# Altium schematic sheet IMDAMSLatching.SchDoc
size A4; Date: 2017-12-21; DrawnBy: Tylynn Haddow; Revision: 2; DocumentName: Reset Circuit
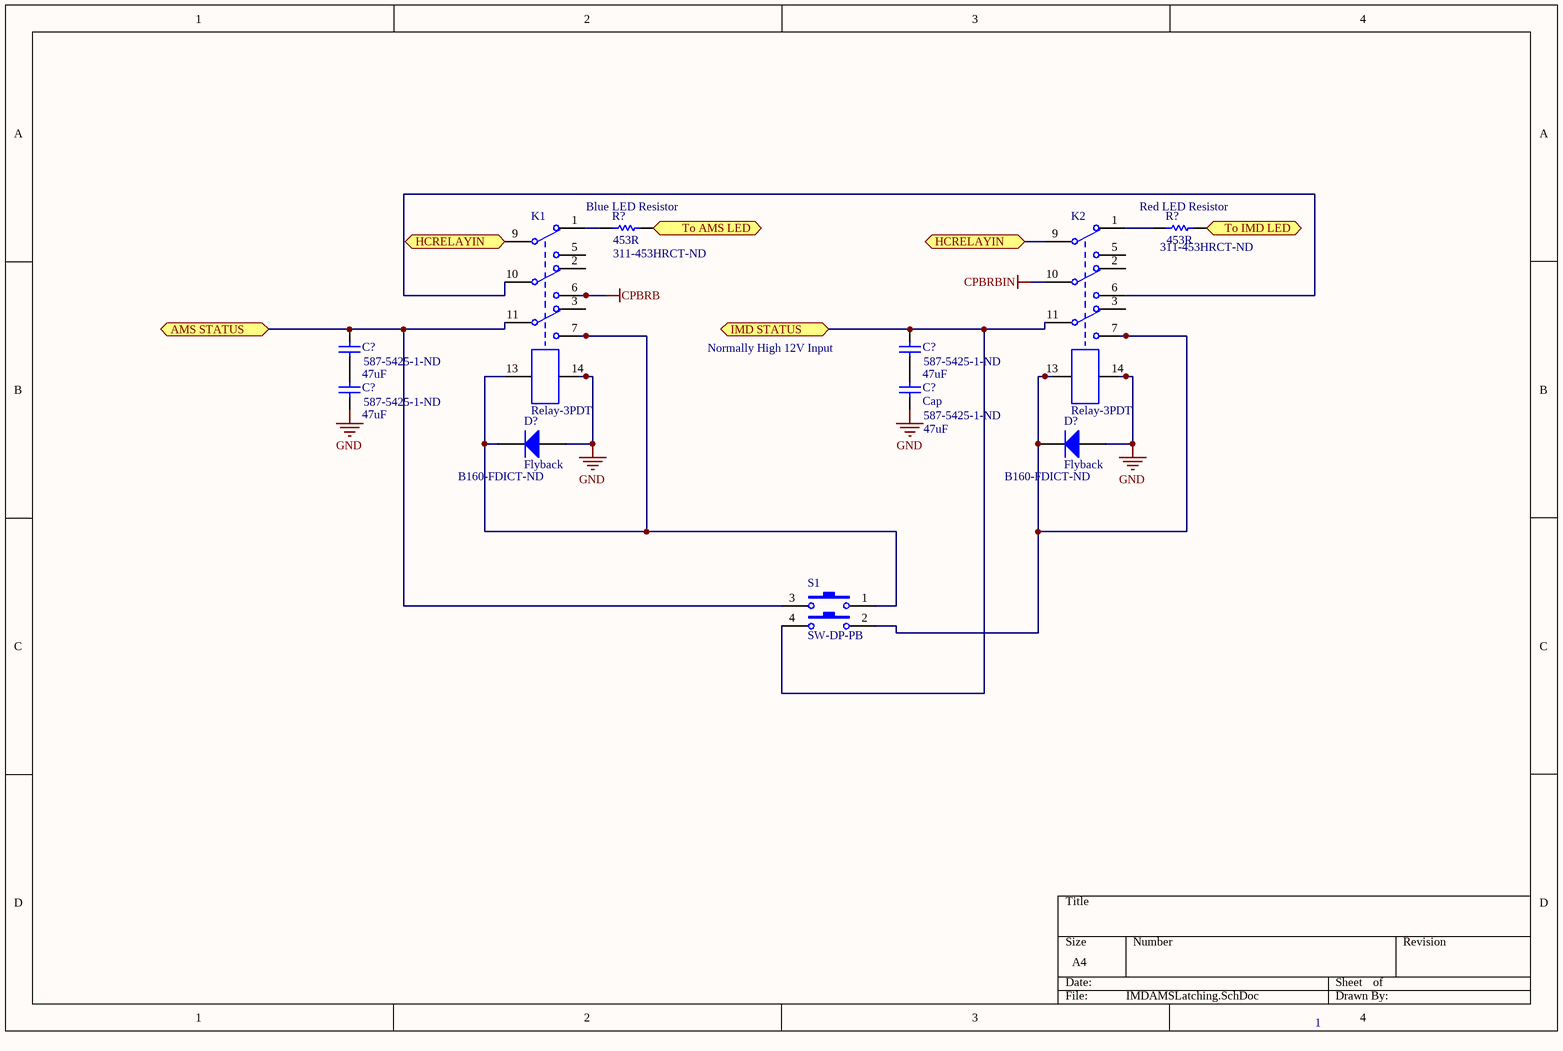
[diagram p0: IMDAMSLatching.SchDoc]

## Parts
(Parts that share a designator on the sheet are numbered #1, #2 ... from top to bottom, then left to right.)
C?#1  value 47uF  Supplier Part Number 1: 587-5425-1-ND  [C1206]  (hidden comment: Cap)
C?#2  value 47uF  Supplier Part Number 1: 587-5425-1-ND  [1206 (High Density)]  (hidden comment: Cap)
C?#3  value 47uF  Supplier Part Number: 587-5425-1-ND  [C1206]  (hidden comment: Cap)
C?#4  Cap  value 47uF  Supplier Part Number 1: 587-5425-1-ND  [C1206]
D?#1  Flyback  Supplier Part Number 1: B160-FDICT-ND  [SOD-123]
D?#2  Flyback  Supplier Part Number 1: B160-FDICT-ND  [SOD-123]
K1  Relay-3PDT
K2  Relay-3PDT
R?#1  Blue LED Resistor  value 453R  Supplier Part Number 1: 311-453HRCT-ND  [0603]
R?#2  Red LED Resistor  value 453R  Supplier Part Number 1: 311-453HRCT-ND  [0603]
S1  SW-DP-PB

## Ports
AMS STATUS (bidir), HCRELAYIN (bidir), IMD STATUS (bidir), To AMS LED (bidir), To IMD LED (bidir)

## Nets
CPBRB: K1.6
CPBRBIN: K2.10
GND: C?#3.1 C?#4.1 D?#1.1(A) D?#2.1(A) K1.14 K2.14
AMS STATUS: C?#1.2 K1.11 S1.3(In) ; port AMS STATUS
HCRELAYIN: K1.9 K2.9 ; port HCRELAYIN
IMD STATUS: C?#2.2 K2.11 S1.4(In) ; port IMD STATUS
To AMS LED: R?#1.1 ; port To AMS LED
To IMD LED: R?#2.1 ; port To IMD LED
NetC?#1_1: C?#1.1 C?#3.2
NetC?#2_1: C?#2.1 C?#4.2
NetD?#1_2: D?#1.2(K) K1.7 K1.13 S1.1(Out)
NetD?#2_2: D?#2.2(K) K2.7 K2.13 S1.2(Out)
NetK1_1: K1.1 R?#1.2
NetK1_10: K1.10 K2.6
NetK2_1: K2.1 R?#2.2

Not connected (* = marked no-connect by the designer): K1 2 3 5; K2 2 3 5

## Notes on the sheet
- Normally High 12V Input
- 1

## Library data of the parts
C?#1-C?#4 = Cap: Capacitor; Published: 8-Jun-2000; LatestRevisionDate: 17-Jul-2002; LatestRevisionNote: Re-released for DXP Platform.; PackageReference: RAD-0.3; Publisher: Altium Limited; PackageDescription: Radial Cap, Thru-Hole; 2 Leads; 0.3 in Pin Spacing
D?#1 D?#2 = Diode: Default Diode; Published: 8-Jun-2000; LatestRevisionDate: 17-Jul-2002; LatestRevisionNote: Re-released for DXP Platform.; PackageVersion: Sep-1996; PackageReference: SMC; Publisher: Altium Limited; PackageDescription: DO-214-AB/SMC; 2 C-Bend Leads; Body 7.9 x 5.9 mm, inc. leads (LxW); Code_JEDEC: DO-214-AB; Supplier 1: Digi-Key
R?#1 R?#2 = Res1: Resistor; Published: 8-Jun-2000; LatestRevisionDate: 17-Jul-2002; LatestRevisionNote: Re-released for DXP Platform.; PackageReference: AXIAL-0.3; Publisher: Altium Limited; PackageDescription: Axial Device, Thru-Hole; 2 Leads; 0.3 in Pin Spacing; Supplier 1: Digi-Key
K1 K2 = Relay-3PDT: ComponentLink1Description: Manufacturer Link; ComponentLink2Description: Datasheet